# Altium schematic sheet 11-CAN _ SD-Card.SchDoc
size A
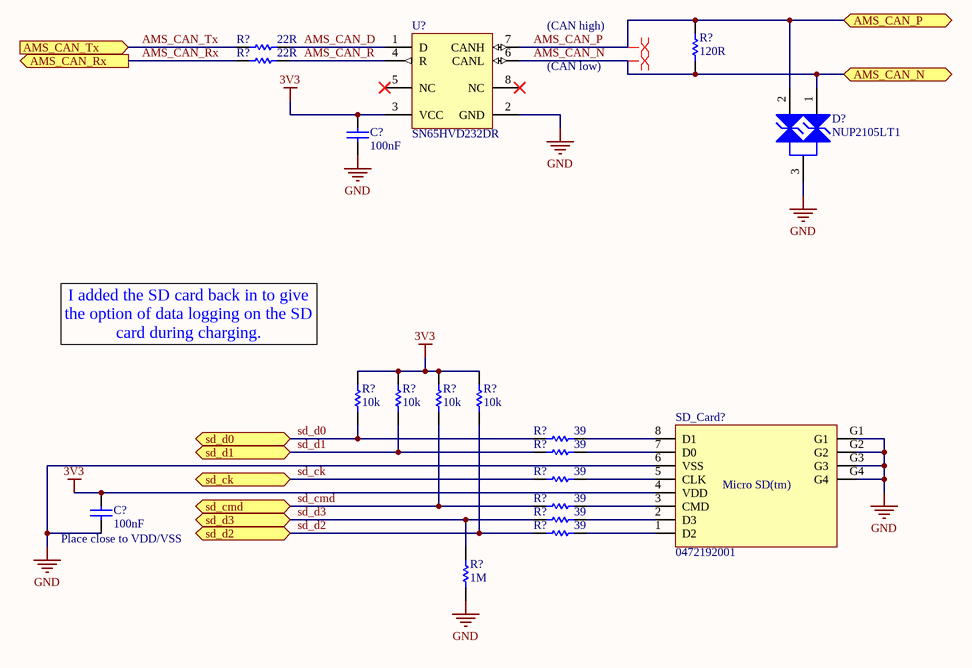
[diagram p0: 11-CAN _ SD-Card.SchDoc]

## Parts
(Parts that share a designator on the sheet are numbered #1, #2 ... from top to bottom, then left to right.)
C?#1  value 100nF  [1608[0603]]  (hidden comment: Cap)
C?#2  value 100nF  [1608[0603]]  (hidden comment: Cap)
D?  NUP2105LT1  [ONSC-SOT-23-3-318-08_V]
R?#1  value 22R  [1608[0603]]  (hidden comment: Res1)
R?#2  value 22R  [1608[0603]]  (hidden comment: Res1)
R?#3  value 120R  [1608[0603]]  (hidden comment: Res1)
R?#4  value 10k  [1608[0603]]  (hidden comment: Res1)
R?#5  value 10k  [1608[0603]]  (hidden comment: Res1)
R?#6  value 10k  [1608[0603]]  (hidden comment: Res1)
R?#7  value 10k  [1608[0603]]  (hidden comment: Res1)
R?#8  value 39  [1608[0603]]  (hidden comment: Res1)
R?#9  value 39  [1608[0603]]  (hidden comment: Res1)
R?#10  value 39  [1608[0603]]  (hidden comment: Res1)
R?#11  value 39  [1608[0603]]  (hidden comment: Res1)
R?#12  value 39  [1608[0603]]  (hidden comment: Res1)
R?#13  value 39  [1608[0603]]  (hidden comment: Res1)
R?#14  value 1M  [1608[0603]]  (hidden comment: Res1)
SD_Card?  0472192001  [MOLX-47219-2001-8_V - Cloned]
U?  SN65HVD232DR  [D0008A_M]

## Ports
AMS_CAN_N (bidir), AMS_CAN_P (bidir), AMS_CAN_Rx (out), AMS_CAN_Tx (in), sd_ck (bidir), sd_cmd (bidir), sd_d0 (bidir), sd_d1 (bidir), sd_d2 (bidir), sd_d3 (bidir)

## Nets
3V3: C?#1.2 C?#2.2 R?#4.2 R?#5.2 R?#6.2 R?#7.2 SD_Card?.4(VDD) U?.3(VCC)
GND: C?#1.1 C?#2.1 D?.3(K) R?#14.1 SD_Card?.6(VSS) SD_Card?.G1 SD_Card?.G2 SD_Card?.G3 SD_Card?.G4 U?.2(GND)
AMS_CAN_D: R?#1.2 U?.1(D)
AMS_CAN_N: D?.1(K) R?#3.1 U?.6(CANL) ; port AMS_CAN_N
AMS_CAN_P: D?.2(K) R?#3.2 U?.7(CANH) ; port AMS_CAN_P
AMS_CAN_R: R?#2.2 U?.4(R)
AMS_CAN_Rx: R?#2.1 ; port AMS_CAN_Rx
AMS_CAN_Tx: R?#1.1 ; port AMS_CAN_Tx
sd_ck: R?#10.1 ; port sd_ck
sd_cmd: R?#6.1 R?#11.1 ; port sd_cmd
sd_d0: R?#4.1 R?#8.1 ; port sd_d0
sd_d1: R?#5.1 R?#9.1 ; port sd_d1
sd_d2: R?#7.1 R?#13.1 ; port sd_d2
sd_d3: R?#12.1 R?#14.2 ; port sd_d3
NetR?#8_2: R?#8.2 SD_Card?.8(D1)
NetR?#9_2: R?#9.2 SD_Card?.7(D0)
NetR?#10_2: R?#10.2 SD_Card?.5(CLK)
NetR?#11_2: R?#11.2 SD_Card?.3(CMD)
NetR?#12_2: R?#12.2 SD_Card?.2(D3)
NetR?#13_2: R?#13.2 SD_Card?.1(D2)

Not connected (* = marked no-connect by the designer): U? 5(NC)* 8(NC)*

## Layout directives
differential pair: AMS_CAN_N, AMS_CAN_P

## Notes on the sheet
- (CAN high)
- (CAN low)
- I added the SD card back in to give the option of data logging on the SD card during charging.
- (near C?#2) Place close to VDD/VSS
- (in symbol 0472192001) Micro SD(tm)

## Library data of the parts
C?#1 C?#2 = Cap: Capacitor; Manufacturer: Yageo; Manufacturer Part Number: CC0603KRX7R9BB104; Capacitance: 0.10µF; Tolerance: ±10%; Voltage - Rated: 50V; Temperature Coefficient: X7R; Supplier 1: Digi-Key; Supplier Part Number 1: 311-1344-1-ND; RoHS: RoHS Compliant; Category: Capacitors; Stock 1: 4016262; Pricing 1: 1=0.15, 10=0.043, 25=0.0312, 50=0.0232, 100=0.0189, 250=0.0158, 500=0.01346, 1000=0.01059 (CAD); Packaging: Cut Tape (CT); Part Status: Active; Operating Temperature: -55°C ~ 125°C; Features: -; Ratings: -; Applications: General Purpose; Failure Rate: -; Mounting Type: Surface Mount, MLCC; Package / Case: 0603 (1608 Metric); Size / Dimension: 0.063" L x 0.031" W (1.60mm x 0.80mm); Height - Seated (Max): -; Thickness (Max): 0.035" (0.90mm); Lead Spacing: -; Lead Style: -; ComponentLink1URL: http://www.yageo.com/documents/recent/UPY-GPHC_X7R_6.3V-to-50V_16.pdf; ComponentLink1Description: http://www.yageo.com/documents/recent/UPY-GPHC_X7R_6.3V-to-50V_16.pdf
D? = CMP-1063-00165-1: Dual Line CAN Bus Protector, 3-Pin SOT-23, Tape and Reel; Manufacturer: On Semiconductor; Manufacturer Part Number: NUP2105LT1G; PPK Max (W): 350; IR Max (uA): 0.1; Number of Lines: 2; V(BR) Min (V): 26.2; Direction: Bidirectional; C Max (pF): 30; Type: Zener; Voltage - Reverse Standoff (Typ): 24V (Min); Voltage - Breakdown (Min): 26.2V; Voltage - Clamping (Max) @ Ipp: 44V; Current - Peak Pulse (10/1000µs): 8A (8/20µs); Power - Peak Pulse: 350W; Power Line Protection: No; Capacitance @ Frequency: 30pF @ 1MHz; PackageDescription: 3-Pin Small Outline Transistor, Body 2.92 x 1.3 mm, Pitch 0.95 mm; ComponentLink2URL: http://www.onsemi.cn/pub_link/Collateral/NUP2105L-D.PDF; ComponentLink3Description: Package Specification; ComponentLink2Description: Datasheet; ComponentLink1URL: http://www.onsemi.com/; Mounting Technology: Surface Mount; ComponentLink1Description: Manufacturer URL; Packing: Tape and Reel; PackageVersion: Rev. AP, 11/2009; PartNumber: NUP2105LT1; DatasheetVersion: Rev. 5; ComponentLink3URL: http://www.onsemi.cn/pub_link/Collateral/318-08.PDF; PackageReference: SOT-23-3-318-08; Supplier 1: Digi-Key; Supplier Part Number 1: NUP2105LT1GOSCT-ND; RoHS: RoHS Compliant; Category: Circuit Protection; Stock 1: 198402; Pricing 1: 1=0.59, 10=0.474, 100=0.3224, 500=0.24186, 1000=0.1814 (CAD); Packaging: Cut Tape (CT); Part Status: Active; Unidirectional Channels: -; Bidirectional Channels: 2; Applications: Automotive; Operating Temperature: -55°C ~ 150°C (TJ); Mounting Type: Surface Mount; Package / Case: TO-236-3, SC-59, SOT-23-3; Supplier Device Package: SOT-23-3 (TO-236); ComponentLink4URL: http://www.onsemi.com/pub_link/Collateral/NUP2105L-D.PDF; ComponentLink4Description: http://www.onsemi.com/pub_link/Collateral/NUP2105L-D.PDF
R?#1 R?#2 = Res1: Resistor; Manufacturer: Yageo; Manufacturer Part Number: RC0603JR-0722RL; Resistance (Ohms): 22; Tolerance: ±5%; Power (Watts): 0.1W, 1/10W; Temperature Coefficient: ±100ppm/°C; Supplier 1: Digi-Key; Supplier Part Number 1: 311-22GRCT-ND; RoHS: RoHS Compliant; Category: Resistors; Stock 1: 603781; Pricing 1: 1=0.16, 10=0.016, 25=0.0112, 50=0.0084, 100=0.0062, 250=0.0048, 500=0.00382, 1000=0.00281 (CAD); Packaging: Cut Tape (CT); Part Status: Active; Composition: Thick Film; Features: Moisture Resistant; Operating Temperature: -55°C ~ 155°C; Package / Case: 0603 (1608 Metric); Supplier Device Package: 0603; Size / Dimension: 0.063" L x 0.031" W (1.60mm x 0.80mm); Height - Seated (Max): 0.022" (0.55mm); Number of Terminations: 2; Failure Rate: -; ComponentLink1URL: http://www.yageo.com/NewPortal/yageodocoutput?fileName=/pdf/R-Chip/PYu-RC_Group_51_RoHS_L_4.pdf; ComponentLink1Description: http://www.yageo.com/NewPortal/yageodocoutput?fileName=/pdf/R-Chip/PYu-RC_Group_51_RoHS_L_4.pdf
R?#3 = Res1: Resistor; Manufacturer: Panasonic Electronic Components; Manufacturer Part Number: ERJ-PA3F1200V; Resistance (Ohms): 120; Tolerance: ±1%; Power (Watts): 0.25W, 1/4W; Temperature Coefficient: ±100ppm/°C; Supplier 1: Digi-Key; Supplier Part Number 1: P120BYCT-ND; RoHS: RoHS Compliant; Category: Resistors; Stock 1: 15009; Pricing 1: 1=0.22, 10=0.198, 25=0.138, 50=0.1072, 100=0.0765, 250=0.05972, 500=0.04746, 1000=0.03368 (CAD); Packaging: Cut Tape (CT); Part Status: Active; Composition: Thick Film; Features: Automotive AEC-Q200, Pulse Withstanding; Operating Temperature: -55°C ~ 155°C; Package / Case: 0603 (1608 Metric); Supplier Device Package: 0603; Size / Dimension: 0.063" L x 0.031" W (1.60mm x 0.80mm); Height - Seated (Max): 0.022" (0.55mm); Number of Terminations: 2; Failure Rate: -; ComponentLink1URL: https://industrial.panasonic.com/cdbs/www-data/pdf/RDA0000/AOA0000C243.pdf; ComponentLink1Description: https://industrial.panasonic.com/cdbs/www-data/pdf/RDA0000/AOA0000C243.pdf
R?#4-R?#7 = Res1: Resistor; Manufacturer: Yageo; Manufacturer Part Number: RC0603JR-0710KL; Tolerance: ±5%; Power (Watts): 0.1W, 1/10W; Temperature Coefficient: ±100ppm/°C; Supplier 1: Digi-Key; Supplier Part Number 1: 311-10KGRCT-ND; RoHS: RoHS Compliant; Category: Resistors; Stock 1: 2936292; Pricing 1: 1=0.16, 10=0.016, 25=0.0112, 50=0.0084, 100=0.0062, 250=0.0048, 500=0.00382, 1000=0.00281 (CAD); Packaging: Cut Tape (CT); Part Status: Active; Resistance (Ohms): 10k; Composition: Thick Film; Features: Moisture Resistant; Operating Temperature: -55°C ~ 155°C; Package / Case: 0603 (1608 Metric); Supplier Device Package: 0603; Size / Dimension: 0.063" L x 0.031" W (1.60mm x 0.80mm); Height - Seated (Max): 0.022" (0.55mm); Number of Terminations: 2; Failure Rate: -; ComponentLink1URL: http://www.yageo.com/NewPortal/yageodocoutput?fileName=/pdf/R-Chip/PYu-RC_Group_51_RoHS_L_4.pdf; ComponentLink1Description: http://www.yageo.com/NewPortal/yageodocoutput?fileName=/pdf/R-Chip/PYu-RC_Group_51_RoHS_L_4.pdf
R?#8-R?#13 = Res1: Resistor; Manufacturer: Yageo; Manufacturer Part Number: RC0603JR-0739RL; Tolerance: ±5%; Power (Watts): 0.1W, 1/10W; Temperature Coefficient: ±100ppm/°C; Supplier 1: Digi-Key; Supplier Part Number 1: 311-39GRCT-ND; RoHS: RoHS Compliant; Category: Resistors; Stock 1: 49762; Pricing 1: 1=0.16, 10=0.016, 25=0.0112, 50=0.0084, 100=0.0062, 250=0.0048, 500=0.00382, 1000=0.00281 (CAD); Packaging: Cut Tape (CT); Part Status: Active; Resistance (Ohms): 39; Composition: Thick Film; Features: Moisture Resistant; Operating Temperature: -55°C ~ 155°C; Package / Case: 0603 (1608 Metric); Supplier Device Package: 0603; Size / Dimension: 0.063" L x 0.031" W (1.60mm x 0.80mm); Height - Seated (Max): 0.022" (0.55mm); Number of Terminations: 2; Failure Rate: -; ComponentLink1URL: http://www.yageo.com/NewPortal/yageodocoutput?fileName=/pdf/R-Chip/PYu-RC_Group_51_RoHS_L_4.pdf; ComponentLink1Description: http://www.yageo.com/NewPortal/yageodocoutput?fileName=/pdf/R-Chip/PYu-RC_Group_51_RoHS_L_4.pdf
R?#14 = Res1: Resistor; Manufacturer: Yageo; Manufacturer Part Number: RC0603FR-071ML; Tolerance: ±1%; Power (Watts): 0.1W, 1/10W; Temperature Coefficient: ±100ppm/°C; Supplier 1: Digi-Key; Supplier Part Number 1: 311-1.00MHRCT-ND; RoHS: RoHS Compliant; Category: Resistors; Stock 1: 3653976; Pricing 1: 1=0.16, 10=0.02, 25=0.0144, 50=0.011, 100=0.0081, 250=0.0062, 500=0.00494, 1000=0.00364 (CAD); Packaging: Cut Tape (CT); Part Status: Active; Resistance (Ohms): 1M; Composition: Thick Film; Features: Moisture Resistant; Operating Temperature: -55°C ~ 155°C; Package / Case: 0603 (1608 Metric); Supplier Device Package: 0603; Size / Dimension: 0.063" L x 0.031" W (1.60mm x 0.80mm); Height - Seated (Max): 0.022" (0.55mm); Number of Terminations: 2; Failure Rate: -; ComponentLink1URL: http://www.yageo.com/NewPortal/yageodocoutput?fileName=/pdf/R-Chip/PYu-RC_Group_51_RoHS_L_4.pdf; ComponentLink1Description: http://www.yageo.com/NewPortal/yageodocoutput?fileName=/pdf/R-Chip/PYu-RC_Group_51_RoHS_L_4.pdf
U? = CMP-0315-00075-2: 3.3 V Can Transceiver, 17 mA, -40 to 85 degC, 8-pin SOIC (D), Green (RoHS & no Sb/Br); Manufacturer: Texas Instruments; Supply Voltage(s)(V): 3.3; Receivers Per Package: 1; ICC(Max)(mA): 17; Rating: Catalog; Transient Pulse Protection(V): -25 to 25; Number of Drivers/Receivers: 1/1; Duplex: Half; Receiver Hysteresis: 100mV; Data Rate: 1Mbps; Voltage - Supply: 3 V ~ 3.6 V; Mounting Technology: Surface Mount; PartNumber: SN65HVD232DR; Code_JEDEC: MS-012AA; Eco-Plan: Green (RoHS & no Sb/Br); Isolated: No; SubFamily: CAN; Footprint: SN65HVD232; Drivers Per Package: 1; ComponentLink1URL: http://www.ti.com/general/docs/lit/getliterature.tsp?genericPartNumber=SN65HVD232&fileType=pdf; ComponentLink1Description: Datasheet; PackageDescription: 8-Pin Plastic Small Outline Integrated Circuit, 4.9 x 3.9 mm, Pitch 1.27 mm Pitch; PackageReference: D0008A; DatasheetVersion: SLOS346K; PackageVersion: revM, Jun-2011; Supplier 1: Digi-Key; Supplier Part Number 1: 296-26344-1-ND; Manufacturer Part Number: SN65HVD232DR; RoHS: RoHS Compliant; Category: Integrated Circuits (ICs); Stock 1: 14686; Pricing 1: 1=2.82, 10=2.523, 100=2.0239, 500=1.66346, 1000=1.15518 (CAD); Packaging: Cut Tape (CT); Part Status: Active; Type: Transceiver; Protocol: CAN; Operating Temperature: -40°C ~ 85°C; Mounting Type: Surface Mount; Package / Case: 8-SOIC (0.154", 3.90mm Width); Supplier Device Package: 8-SOIC; ComponentLink3URL: http://www.ti.com/lit/ds/symlink/sn65hvd230.pdf; ComponentLink3Description: http://www.ti.com/lit/ds/symlink/sn65hvd230.pdf
SD_Card? = 0472192001: Digikey Part Number: WM6698CT-ND; Manufacturer Part Number: 0472192001; Digikey Link: http://www.digikey.ca/product-detail/en/molex-llc/0472192001/WM6698CT-ND/3044147; Supplier 1: Digi-Key; Supplier Part Number 1: WM6698CT-ND